# EAGLE design pilly (EAGLE 7.2.0)
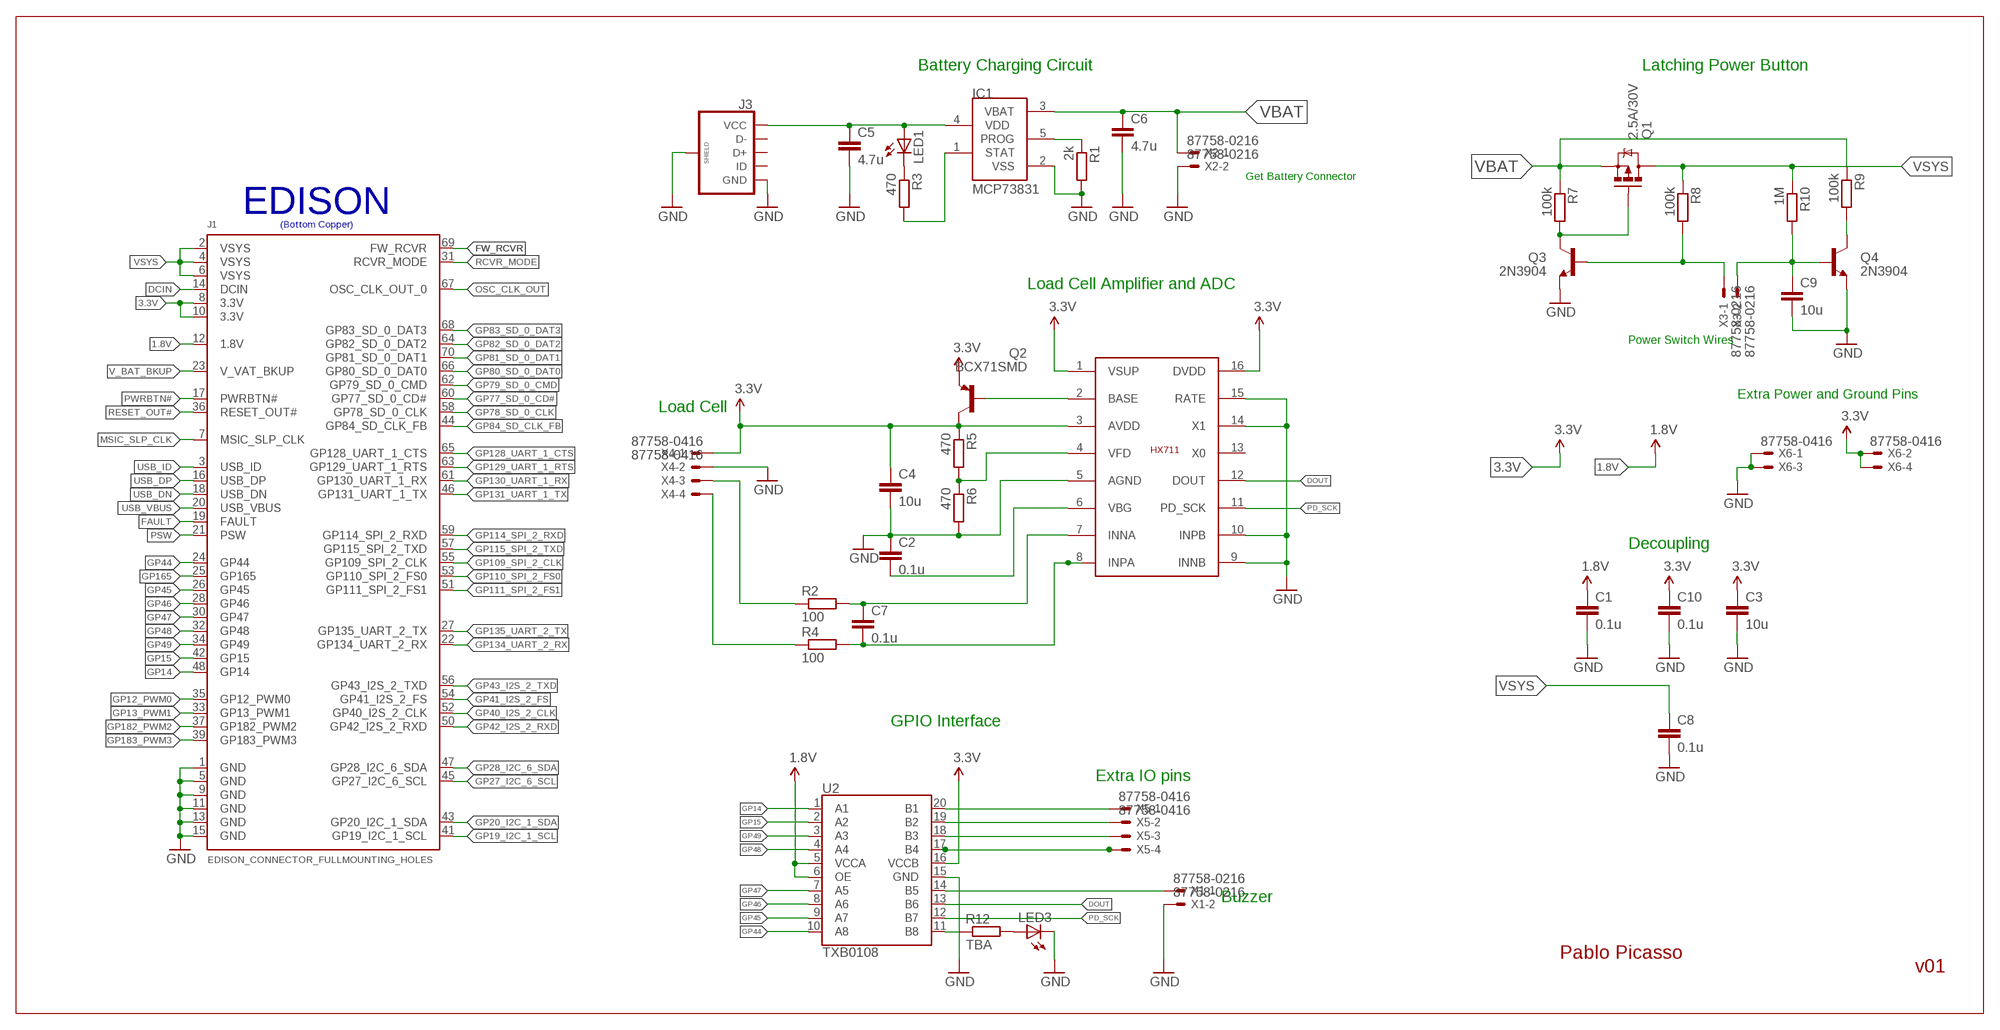
[diagram p0: schematic, sheet 1]

## Parts
C1  0.1u  C-EUC0805K  [C0805K]
C2  0.1u  C-EUC0805K  [C0805K]
C3  10u  C-EUC0805K  [C0805K]
C4  10u  C-EUC0805K  [C0805K]
C5  4.7u  C-EUC0805K  [C0805K]
C6  4.7u  C-EUC0805K  [C0805K]
C7  0.1u  C-EUC0805K  [C0805K]
C8  0.1u  C-EUC0805K  [C0805K]
C9  10u  C-EUC0805K  [C0805K]
C10  0.1u  C-EUC0805K  [C0805K]
IC1  MCP73831  [SOT23-5L]
J1  EDISON_CONNECTOR_FULLMOUNTING_HOLES  [EDISON_DAUGHTER]
J3  USB_MICROB_PLUGCONN-11752  [USB-B-MICRO-SMD_V03]
LED1  LEDCHIPLED_0805  [CHIPLED_0805]
LED3  LEDCHIPLED_0805  [CHIPLED_0805]
Q1  2.5A/30V  MOSFET-PCHANNELDMG2307L  [SOT23-3]
Q2  BCX71SMD  [SOT23]
Q3  2N3904  TRANSISTOR_NPNMMBT2222A  [SOT23-3]
Q4  2N3904  TRANSISTOR_NPNMMBT2222A  [SOT23-3]
R1  2k  R-EU_R0603  [R0603]
R2  100  R-EU_R0603  [R0603]
R3  470  R-EU_R0603  [R0603]
R4  100  R-EU_R0603  [R0603]
R5  470  R-EU_R0603  [R0603]
R6  470  R-EU_R0603  [R0603]
R7  100k  R-EU_R0603  [R0603]
R8  100k  R-EU_R0603  [R0603]
R9  100k  R-EU_R0603  [R0603]
R10  1M  R-EU_R0603  [R0603]
R12  TBA  R-EU_R0603  [R0603]
U2  TXB0108  [UFDFN-20]
U$1  HX711  [SO16]
X1  87758-0216  [87758-0216]
X2  87758-0216  [87758-0216]
X3  87758-0216  [87758-0216]
X4  87758-0416  [87758-0416]
X5  87758-0416  [87758-0416]
X6  87758-0416  [87758-0416]

## Nets
1.8V: C1.1 J1.12(1.8V) U2.5(VCCA) U2.6(OE)
3.3V: C3.1 C4.1 C10.1 J1.8(3.3V) J1.10(3.3V) Q2.2(E) Q2.3(C) R5.1 U2.16(VCCB) U$1.1(VSUP) U$1.3(AVDD) U$1.16(DVDD) X4.1 X6.2 X6.4
DCIN: J1.14(DCIN)
DOUT: U2.13(B6) U$1.12(DOUT)
FAULT: J1.19(FAULT)
FW_RCVR: J1.69(FW_RCVR)
GND: C1.2 C2.1 C3.2 C4.2 C5.2 C6.2 C8.2 C9.2 C10.2 IC1.2(VSS) J1.1(GND) J1.5(GND) J1.9(GND) J1.11(GND) J1.13(GND) J1.15(GND) J3.GND J3.SHIELD1(SHIELD) J3.SHIELD2(SHIELD) J3.SHIELD3(SHIELD) LED3.C Q3.2(E) Q4.2(E) R1.2 R6.2 U2.15(GND) U$1.5(AGND) U$1.9(INNB) U$1.10(INPB) U$1.14(X1) U$1.15(RATE) X1.2 X2.2 X4.2 X6.1 X6.3
GP12_PWM0: J1.35(GP12_PWM0)
GP13_PWM1: J1.33(GP13_PWM1)
GP14: J1.48(GP14) U2.1(A1)
GP15: J1.42(GP15) U2.2(A2)
GP19_I2C_1_SCL: J1.41(GP19_I2C_1_SCL)
GP20_I2C_1_SDA: J1.43(GP20_I2C_1_SDA)
GP27_I2C_6_SCL: J1.45(GP27_I2C_6_SCL)
GP28_I2C_6_SDA: J1.47(GP28_I2C_6_SDA)
GP40_I2S_2_CLK: J1.52(GP40_I2S_2_CLK)
GP41_I2S_2_FS: J1.54(GP41_I2S_2_FS)
GP42_I2S_2_RXD: J1.50(GP42_I2S_2_RXD)
GP43_I2S_2_TXD: J1.56(GP43_I2S_2_TXD)
GP44: J1.24(GP44) U2.10(A8)
GP45: J1.26(GP45) U2.9(A7)
GP46: J1.28(GP46) U2.8(A6)
GP47: J1.30(GP47) U2.7(A5)
GP48: J1.32(GP48) U2.4(A4)
GP49: J1.34(GP49) U2.3(A3)
GP77_SD_0_CD#: J1.60(GP77_SD_0_CD#)
GP78_SD_0_CLK: J1.58(GP78_SD_0_CLK)
GP79_SD_0_CMD: J1.62(GP79_SD_0_CMD)
GP80_SD_0_DAT0: J1.66(GP80_SD_0_DAT0)
GP81_SD_0_DAT1: J1.70(GP81_SD_0_DAT1)
GP82_SD_0_DAT2: J1.64(GP82_SD_0_DAT2)
GP83_SD_0_DAT3: J1.68(GP83_SD_0_DAT3)
GP84_SD_CLK_FB: J1.44(GP84_SD_CLK_FB)
GP109_SPI_2_CLK: J1.55(GP109_SPI_2_CLK)
GP110_SPI_2_FS0: J1.53(GP110_SPI_2_FS0)
GP111_SPI_2_FS1: J1.51(GP111_SPI_2_FS1)
GP114_SPI_2_RXD: J1.59(GP114_SPI_2_RXD)
GP115_SPI_2_TXD: J1.57(GP115_SPI_2_TXD)
GP128_UART_1_CTS: J1.65(GP128_UART_1_CTS)
GP129_UART_1_RTS: J1.63(GP129_UART_1_RTS)
GP130_UART_1_RX: J1.61(GP130_UART_1_RX)
GP131_UART_1_TX: J1.46(GP131_UART_1_TX)
GP134_UART_2_RX: J1.22(GP134_UART_2_RX)
GP135_UART_2_TX: J1.27(GP135_UART_2_TX)
GP165: J1.25(GP165)
GP182_PWM2: J1.37(GP182_PWM2)
GP183_PWM3: J1.39(GP183_PWM3)
MSIC_SLP_CLK: J1.7(MSIC_SLP_CLK)
N$1: LED1.C R3.1
N$2: IC1.5(PROG) R1.1
N$3: U2.14(B5) X1.1
N$5: R5.2 R6.1 U$1.4(VFD)
N$6: IC1.1(STAT) R3.2
N$7: C7.1 R2.2 U$1.7(INNA)
N$8: C7.2 R4.2 U$1.8(INPA)
N$9: C2.2 U$1.6(VBG)
N$10: Q2.1(B) U$1.2(BASE)
N$11: R2.1 X4.3
N$12: R4.1 X4.4
N$15: U2.20(B1) X5.1
N$16: Q1.1(G) Q3.3(C) R7.2
N$17: Q4.3(C) R9.2
N$18: C9.1 Q4.1(B) R10.2 X3.2
N$19: U2.19(B2) X5.2
N$20: U2.18(B3) X5.3
N$21: Q3.1(B) R8.2 X3.1
N$23: LED3.A R12.2
N$31: U2.17(B4) X5.4
N$33: R12.1 U2.11(B8)
OSC_CLK_OUT: J1.67(OSC_CLK_OUT_0)
PD_SCK: U2.12(B7) U$1.11(PD_SCK)
PSW: J1.21(PSW)
PWRBTN#: J1.17(PWRBTN#)
RCVR_MODE: J1.31(RCVR_MODE)
RESET_OUT#: J1.36(RESET_OUT#)
USB_DN: J1.18(USB_DN)
USB_DP: J1.16(USB_DP)
USB_ID: J1.3(USB_ID)
USB_VBUS: J1.20(USB_VBUS)
V_BAT_BKUP: J1.23(V_VAT_BKUP)
VBAT: C6.1 IC1.3(VBAT) Q1.2(S) R7.1 R9.1 X2.1
VIN: C5.1 IC1.4(VDD) J3.VBUS(VCC) LED1.A
VSYS: C8.1 J1.2(VSYS) J1.4(VSYS) J1.6(VSYS) Q1.3(D) R8.1 R10.1
Unconnected: J3.D+ J3.D- J3.ID U$1.13(X0)

## Notes on the sheet
- Battery Charging Circuit | Latching Power Button
- Get Battery Connector
- EDISON
- (Bottom Copper)
- Load Cell Amplifier and ADC
- Power Switch Wires
- Extra Power and Ground Pins
- Load Cell
- Decoupling
- GPIO Interface
- Extra IO pins
- Buzzer
- Pablo Picasso
- v01

## Library data of the parts
C1-C10 = rcl:C-EU: CAPACITOR, European symbol
IC1 = microchip-update-2:MCP73831: Miniature Single-Cell, Fully Integrated Li-Ion, Li-Polymer Charge Management Controllers
J1 = Edison:EDISON_CONNECTOR_FULL
J3 = SparkFun-Connectors:USB_MICROB_PLUG: USB Micro-B connectors Some male, some female. Watch your step!; PROD_ID: CONN-11752
LED1 LED3 = led:LED: LED OSRAM: - CHIPLED LG R971, LG N971, LY N971, LG Q971, LY Q971, LO R971, LY R971 LH N974, LH R974 LS Q976, LO Q976, LY Q976 LO Q996 - Hyper CHIPLED LW Q18S LB Q993, LB Q99A, LB R99A - SideLED LS A670, LO A670, LY A670, LG A670, LP A670 LB A673, LV A673, LT A673, LW A673 LH A674 LY A675 LS A676, LA A676, LO A676, LY A676, LW A676 LS A679, LY A679, LG A679 - Hyper Micro SIDELED® LS Y876, LA Y876, LO Y876, LY Y876 LT Y87S - SmartLED LW L88C, LW L88S LB L89C, LB L89S, LG L890 LS L89K, LO L89K, LY L89K LS L896, LA L896, LO L896, LY L896 - TOPLED LS T670, LO T670, LY T670, LG T670, LP T670 LSG T670, LSP T670, LSY T670, LOP T670, LYG T670 LG T671, LOG T671, LSG T671 LB T673, LV T673, LT T673, LW T673 LH T674 LS T676, LA T676, LO T676, LY T676, LB T676, LH T676, LSB T676, LW T676 LB T67C, LV T67C, LT T67C, LS T67K, LO T67K, LY T67K, LW E67C LS E67B, LA E67B, LO E67B, LY E67B, LB E67C, LV E67C, LT E67C LW T67C LS T679, LY T679, LG T679 LS T770, LO T770, LY T770, LG T770, LP T770 LB T773, LV T773, LT T773, LW T773 LH T774 LS E675, LA E675, LY E675, LS T675 LS T776, LA T776, LO T776, LY T776, LB T776 LHGB T686 LT T68C, LB T68C - Hyper Mini TOPLED® LB M676 - Mini TOPLED Santana® LG M470 LS M47K, LO M47K, LY M47K Source: http://www.osram.convergy.de LUXEON: - LUMILED® LXK2-PW12-R00, LXK2-PW12-S00, LXK2-PW14-U00, LXK2-PW14-V00 LXK2-PM12-R00, LXK2-PM12-S00, LXK2-PM14-U00 LXK2-PE12-Q00, LXK2-PE12-R00, LXK2-PE12-S00, LXK2-PE14-T00, LXK2-PE14-U00 LXK2-PB12-K00, LXK2-PB12-L00, LXK2-PB12-M00, LXK2-PB14-N00, LXK2-PB14-P00, LXK2-PB14-Q00 LXK2-PR12-L00, LXK2-PR12-M00, LXK2-PR14-Q00, LXK2-PR14-R00 LXK2-PD12-Q00, LXK2-PD12-R00, LXK2-PD12-S00 LXK2-PH12-R00, LXK2-PH12-S00 LXK2-PL12-P00, LXK2-PL12-Q00, LXK2-PL12-R00 Source: www.luxeon.com KINGBRIGHT: KA-3528ASYC Source: www.kingbright.com
Q1 = SparkFun-DiscreteSemi:MOSFET-PCHANNEL: Generic PMOSFET IRLML2244 - TRANS-11153 (SOT-23 -20V -4.3A) (1.Gate 2.Source 3.Drain) FQP27P06 - COM-10349 <http://www.sparkfun.com/products/10349> (TO-220 -60V -27A) (1.Gate 2.Source 3.Drain); PROD_ID: TRANS-11308
Q2 = transistor-pnp:BCX71SMD: PNP Transistor
Q3 Q4 = SparkFun-DiscreteSemi:TRANSISTOR_NPN: Generic NPN BJT MMBT2222A - TRANS-08049 (SOT-23, 1A 40V) MPSA42 - TRANS-09116 (SOT-23, 500mA 300V) MMBT5088LT1G - TRANS-11160 (SOT-23, 50 mA 30V) BC547 - COM-08928 <http://www.sparkfun.com/products/8928> (TO-92 45V 100mA) (1.Collector 2.Base 3.Emitter) 2N3904 - COM-00521 <http://www.sparkfun.com/products/521> (TO-92 40V 200mA) (1.Emitter 2.Base 3.Collector) P2N2222A - COM-12852 <http://www.sparkfun.com/products/12852> (TO-92 40V 600mA) (1.Collector 2.Base 3.Emitter); PROD_ID: TRANS-08049; VALUE: MMBT2222A
R1-R10 R12 = rcl:R-EU_: RESISTOR, European symbol
U2 = SparkFun-DigitalIC:TXB0108: 8-Bit Bi-Directional Level Shifter 1.2V-3.6V (VCCA) to 1.65V-5.5V (VCCB) bi-directional level shifter with auto direction sensing. Max data rate - VCCA 1.2V: 20Mbps (50ns), VCCA 3.3V: 100Mbps (10ns) Digikey: 296-27217-1-ND (20-UFDFN) IC-12292; PROD_ID: IC-12292
U$1 = HX711:HX711
X1-X3 = con-molex:87758-0216: 2 Pin - 2mm Dual Row Single Wafer, Vertical T/H HDR Source: http://www.molex.com/pdm_docs/sd/877580616_sd.pdf; MPN: 87758-0216; OC_FARNELL: unknown; OC_NEWARK: 94M1513
X4-X6 = con-molex:87758-0416: 4 Pin - 2mm Dual Row Single Wafer, Vertical T/H HDR Source: http://www.molex.com/pdm_docs/sd/877580616_sd.pdf; MF: FARNELL; MPN: 87758-0416; OC_FARNELL: 7472315; OC_NEWARK: 39K3681

## Board
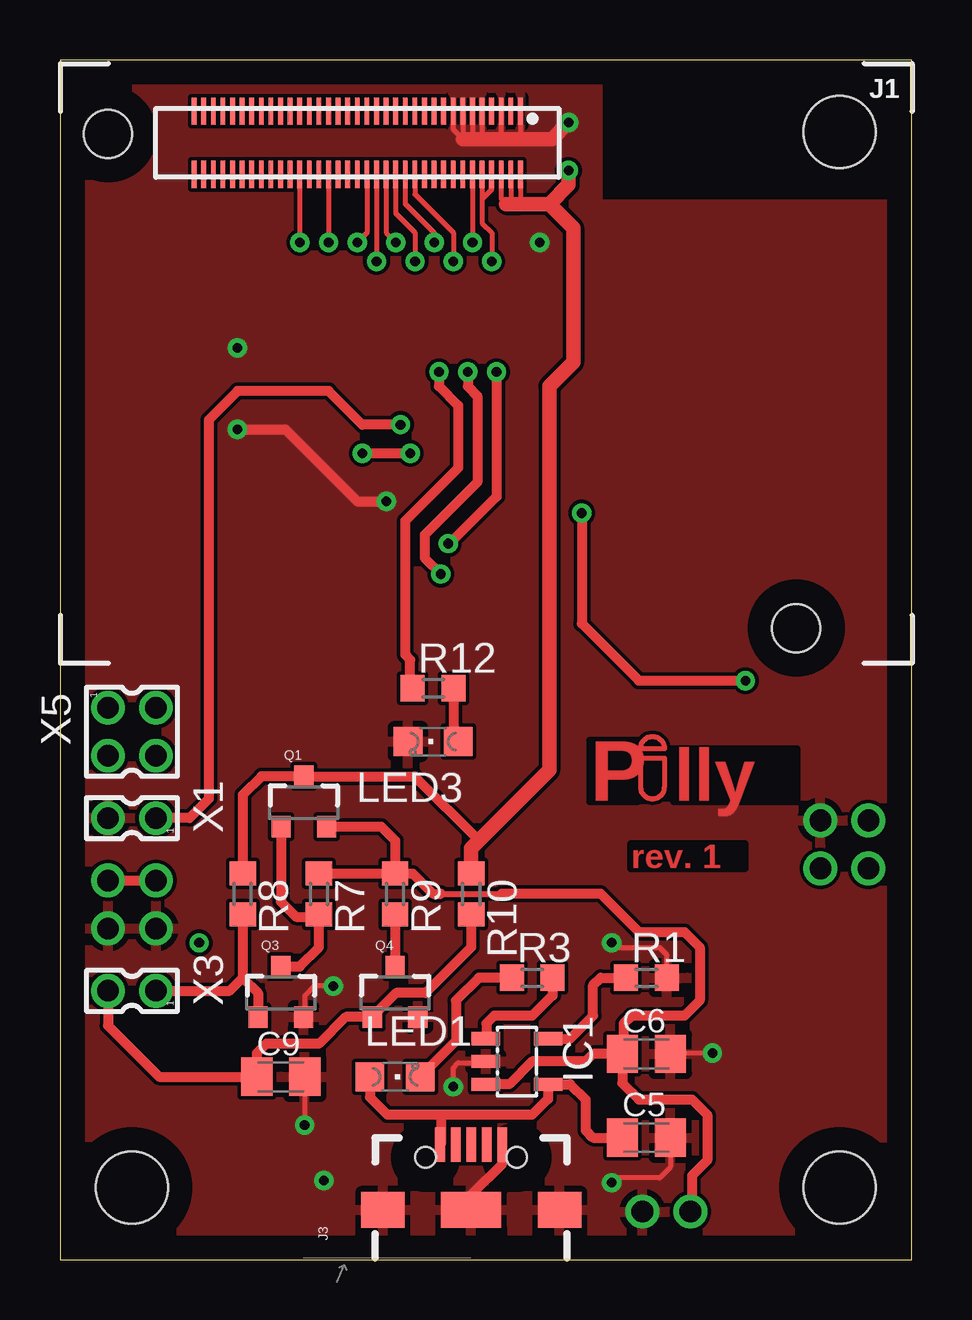
[diagram p1: board, top side]
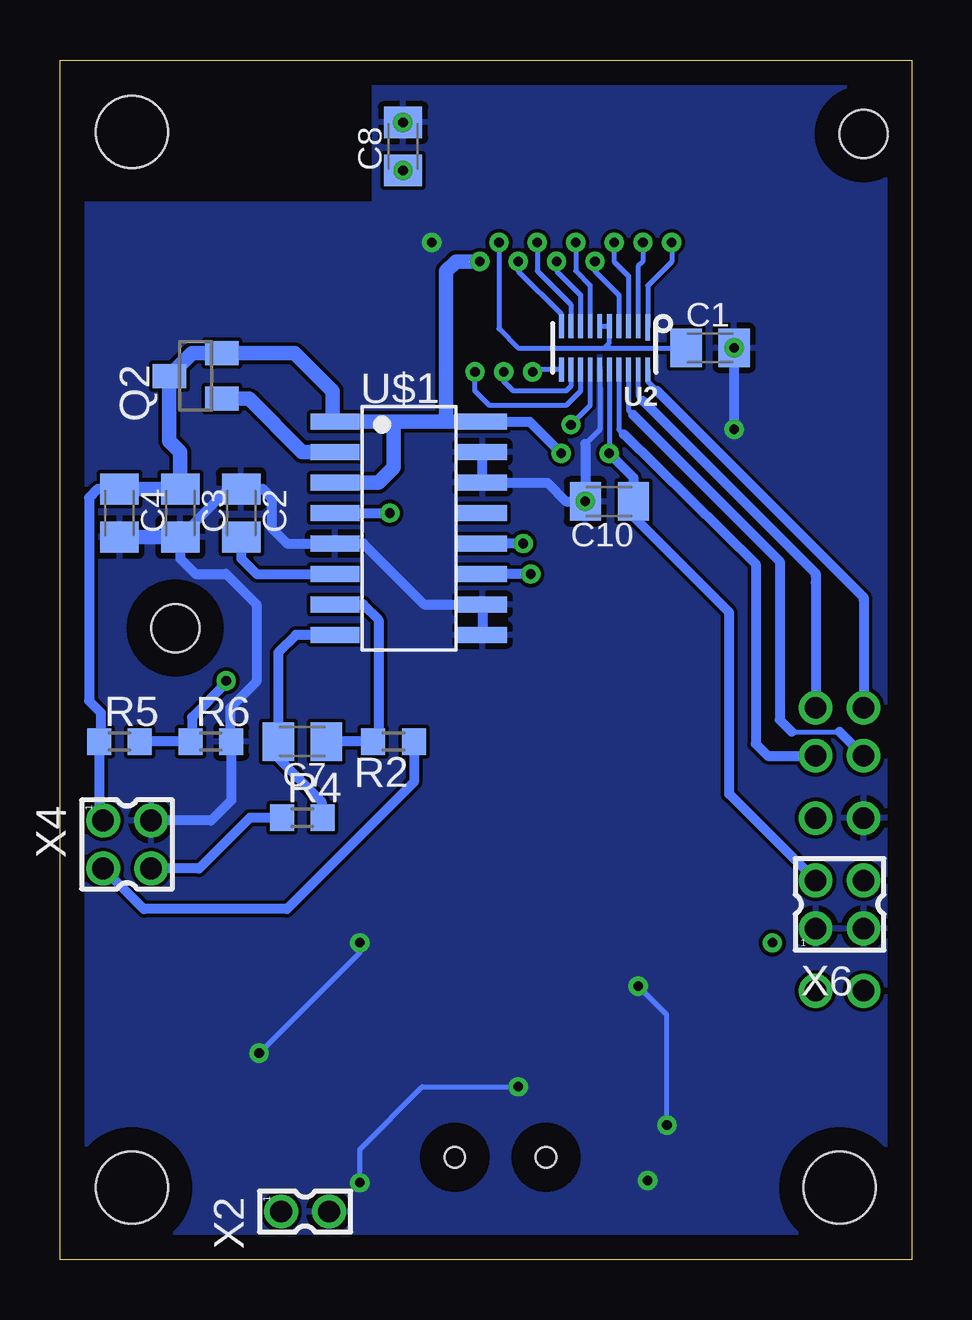
[diagram p2: board, bottom side, seen from below]

Size 35.5 x 50 mm. Coordinates in mm from the lower left corner, seen from the top.
Outline: 0,0 35.5,0 35.5,50 0,50 0,0
Copper layers (1*16): Top 0.035mm / dielectric 1.5mm / Bottom 0.035mm
Design rules "default *": minimum track width 6mil, minimum drill 0.4mm, track to track 6mil, track to pad 6mil, pad to pad 6mil, via to via 6mil, smd to smd 6mil, copper to edge 40mil, drill to drill 8mil, minimum pad ring 10mil, minimum via ring 8mil, stop-mask expansion 4mil, vias tented up to drill 0mil, thermal gap 10mil
Holes 3 mm at 3,3 32.5,3 32.5,47

### Footprints (pad centres in the part's own frame; a part is rotated, then mirrored left to right if it is on the bottom)
C0805K = smd 1.3 x 1.6: 1 -1,0; 2 1,0
SOT23-5L = smd 0.55 x 1.2: 1 -0.95,-1.3; 2 0,-1.3; 3 0.95,-1.3; 4 0.95,1.3; 5 -0.95,1.3
EDISON_DAUGHTER = smd 1.14 x 0.2: 1 1.98,19.17; 2 4.62,19.17; 3 1.98,18.77; 4 4.62,18.77; 5 1.98,18.37; 6 4.62,18.37; 7 1.98,17.97; 8 4.62,17.97; 9 1.98,17.57; 10 4.62,17.57; 11 1.98,17.17; 12 4.62,17.17; 13 1.98,16.77; 14 4.62,16.77; 15 1.98,16.37; 16 4.62,16.37; 17 1.98,15.97; 18 4.62,15.97; 19 1.98,15.57; 20 4.62,15.57; 21 1.98,15.17; 22 4.62,15.17; 23 1.98,14.77; 24 4.62,14.77; 25 1.98,14.37; 26 4.62,14.37; 27 1.98,13.97; 28 4.62,13.97; 29 1.98,13.57; 30 4.62,13.57; 31 1.98,13.17; 32 4.62,13.17; 33 1.98,12.77; 34 4.62,12.77; 35 1.98,12.37; 36 4.62,12.37; 37 1.98,11.97; 38 4.62,11.97; 39 1.98,11.57; 40 4.62,11.57; 41 1.98,11.17; 42 4.62,11.17; 43 1.98,10.77; 44 4.62,10.77; 45 1.98,10.37; 46 4.62,10.37; 47 1.98,9.97; 48 4.62,9.97; 49 1.98,9.57; 50 4.62,9.57; 51 1.98,9.17; 52 4.62,9.17; 53 1.98,8.77; 54 4.62,8.77; 55 1.98,8.37; 56 4.62,8.37; 57 1.98,7.97; 58 4.62,7.97; 59 1.98,7.57; 60 4.62,7.57; 61 1.98,7.17; 62 4.62,7.17; 63 1.98,6.77; 64 4.62,6.77; 65 1.98,6.37; 66 4.62,6.37; 67 1.98,5.97; 68 4.62,5.97; 69 1.98,5.57; 70 4.62,5.57 | hole 2: 23.53,30.67; 2.93,1.98
USB-B-MICRO-SMD_V03 = smd 1.45 x 0.4: D+ 2.725,0; D- 2.725,0.65; GND 2.725,-1.3; ID 2.725,-0.65; VBUS 2.725,1.3 | smd 1.5 x 1.8: SHIELD1 0,3.685; SHIELD2 0,-3.685 | smd 1.5 x 2.5: SHIELD3 0,0 | hole 0.85: 2.2,1.9; 2.2,-1.9
CHIPLED_0805 = smd 1.2 x 1.2: A 0,-1.05; C 0,1.05
SOT23-3 = smd 0.8 x 0.9: 1 -0.95,-1; 2 0.95,-1; 3 0,1.1
SOT23 = smd 1 x 1.4: 1 -0.95,-1.1; 2 0.95,-1.1; 3 0,1.1
R0603 = smd 1 x 1.1: 1 -0.85,0; 2 0.85,0
UFDFN-20 = smd 0.2 x 1.1: 1 -1.8,-0.85 | smd 0.2 x 1: 2 -1.4,-0.9; 3 -1,-0.9; 4 -0.6,-0.9; 5 -0.2,-0.9; 6 0.2,-0.9; 7 0.6,-0.9; 8 1,-0.9; 9 1.4,-0.9; 10 1.8,-0.9; 11 1.8,0.9; 12 1.4,0.9; 13 1,0.9; 14 0.6,0.9; 15 0.2,0.9; 16 -0.2,0.9; 17 -0.6,0.9; 18 -1,0.9; 19 -1.4,0.9; 20 -1.8,0.9
SO16 = smd 0.66 x 2.032: 1 -4.445,-3.073; 2 -3.175,-3.073; 3 -1.905,-3.073; 4 -0.635,-3.073; 5 0.635,-3.073; 6 1.905,-3.073; 7 3.175,-3.073; 8 4.445,-3.073; 9 4.445,3.073; 10 3.175,3.073; 11 1.905,3.073; 12 0.635,3.073; 13 -0.635,3.073; 14 -1.905,3.073; 15 -3.175,3.073; 16 -4.445,3.073
87758-0216 = drill 0.9 pad 1.27: 1 0,-1; 2 0,1
87758-0416 = drill 0.9 pad 1.27: 1 -1,-1; 2 -1,1; 3 1,-1; 4 1,1

### Placement (x,y rotation side)
C1  8.4,38 0 bottom
C2  27.94,31.11 270 bottom
C3  30.48,31.11 270 bottom
C4  33.02,31.11 270 bottom
C5  24.45,5.08 0 top
C6  24.45,8.57 0 top
C7  25.4,21.59 180 bottom
C8  21.2,46.4 90 bottom
C9  9.21,7.62 0 top
C10  12.6,31.6 180 bottom
IC1  19.05,8.26 270 top
J1  0.03,49.85 270 top
J3  17.14,2.06 90 top
LED1  13.97,7.62 270 top
LED3  15.56,21.59 90 top
Q1  10.17,19.04 0 top
Q2  29.84,36.83 90 bottom
Q3  9.21,11.11 0 top
Q4  13.97,11.11 0 top
R1  24.45,11.75 0 top
R2  21.59,21.59 180 bottom
R3  19.68,11.75 0 top
R4  25.4,18.41 0 bottom
R5  33.02,21.59 0 bottom
R6  29.21,21.59 0 bottom
R7  10.79,15.24 270 top
R8  7.62,15.24 270 top
R9  13.97,15.24 270 top
R10  17.14,15.24 270 top
R12  15.56,23.81 0 top
U2  12.8,38 180 bottom
U$1  20.95,30.48 270 bottom
X1  3,18.4 90 top
X2  25.28,2 270 bottom
X3  3,11.2 90 top
X4  32.7,17.3 270 bottom
X5  3,22 270 top
X6  3,14.8 0 bottom

### Tracks (layer width: path | path; a pad name or v marks a point on that pad's centre or on a via)
1.8V  (via drill 0.4)
  Top 0.2: J1.12 v17.2,42.41 v17.2,42.4
  Bottom 0.2: v17.2,42.4 17.2,38.8 16.4,38 12.8,38 | 12.8,38 12.6,38.2 U2.5 U2.6 | 12.8,38 C1.1
3.3V  (via drill 0.4)
  Top 0.2: J1.10 17.59,44.2 | 17.59,44.2 17.59,43.2 18,42.8 v18,41.6 | J1.8 18,44.6 17.59,44.2
  Top 0.406: v14.6,33.6 v12.6,33.6 | X6.4 X6.2
  Bottom 0.2: 19.4,35.12 19.2,34.92 | U2.16 v12.6,33.6
  Bottom 0.406: C4.1 33.92,32.12 34.29,31.75 34.29,23.29 33.8,22.8 33.8,21.66 R5.1 33.87,18.47 X4.1 | U$1.16 15.93,34.92 v14.6,33.6 | X6.2 7.6,19.4 7.6,26.97 11.6,30.97 C10.1 11.6,32.6 v12.6,33.6
  Bottom 0.61: 21.59,34.92 U$1.1 24.13,35.03 24.13,36.2 25.71,37.78 Q2.2 30,37.78 Q2.3 30.95,34.12 30.48,33.66 C3.1 C4.1 | 21.59,34.92 19.2,34.92 U$1.16 | U$1.3 22.23,32.38 21.59,33.02 21.59,34.92 | v18,41.6 19,41.6 19.4,41.2 19.4,35.12
DOUT  (via drill 0.4)
  Top 0.406: v18.2,37 18.2,31.8 16.19,29.79 v16.19,29.84
  Bottom 0.2: U2.13 13.8,36.2 14.4,35.6 17.6,35.6 18.2,36.2 v18.2,37
  Bottom 0.406: v16.19,29.84 U$1.12
GND  (via drill 0.4, 0.4 pad 0.81)
  Top 0.2: J1.15 16.39,47.1 16.8,46.7 | R1.2 25.3,12.7 25,13 23.2,13 v23,13.2 | v27.2,8.6 25.48,8.6 C6.2 | C5.2 25.45,3.85 25,3.4 23.2,3.4 v23,3.2 | v16.4,7.2 16.4,8 16.6,8.2 17.7,8.2 IC1.2 | C9.2 v10.21,5.61 v10.2,5.6 | v11.4,11.4 10.6,11.4 10.2,11 10.2,10.15 Q3.2 | J1.11 17.2,46.91 | 17.2,46.91 17.2,46.9 | J1.9 17.59,46.91 17.6,46.9 | J1.5 18.39,46.91 18.4,46.9 | J1.1 19.2,46.7 | J1.13 16.8,46.91 17,46.7 | 17.2,46.91 17.2,46.7
  Top 0.254: J3.GND 18.45,4 | 17.14,2.7 J3.SHIELD3
  Top 0.406: 18.45,4 17.14,2.7 | v7.4,34.6 9.4,34.6 12.4,31.6 C10.2
  Top 0.61: 16.8,46.7 17,46.7 17.2,46.7 19.2,46.7 20.5,46.7 C8.2
  Bottom 0.2: 15.24,32.38 15.19,32.38 | v23,13.2 23,12.8 v27.2,8.6 | v23,3.2 23,4.6 20.4,7.2 v16.4,7.2 | v10.2,5.6 10.2,10.2 v11.4,11.4 | U2.15 13,34.6 13.6,34
  Bottom 0.406: U$1.15 U$1.14 15.24,32.38 | X4.2 29.2,18.3 28.36,19.14 R6.2 28.4,21.63 28.4,23 27.3,24.09 27.3,27.3 28.57,28.57 29.84,28.57 30.48,29.21 C3.2 28.48,32.12 C2.1 27.04,32.12 26.67,31.75 26.67,30.48 26.04,29.84 U$1.5 22.86,29.84 20.32,27.3 U$1.10 U$1.9 | 15.19,32.38 14.4,31.6 C10.2 13.6,34 | C1.2 v7.4,34.6
  Bottom 0.61: C4.2 C3.2
  other vias: 21.2,47.4 11,3.3 13.6,31.6 7.4,38 20,42.4
  pour Top: 0,0 0.18,49.53 22.4,49.6 22.4,44 35.4,44 35.4,42 35.4,42.09 35.72,0.16
  pour Bottom: 22.4,49.6 22.4,44 35.4,44 35.4,0.2 0.2,0.2 0.2,49.6
GP14  (via drill 0.4)
  Top 0.2: J1.48 v9.99,42.41 v10,42.4
  Bottom 0.2: v10,42.4 10,41.6 11,40.6 U2.1
GP15  (via drill 0.4)
  Top 0.2: J1.42 v11.2,42.41 v11.2,42.4
  Bottom 0.2: v11.2,42.4 11.2,41.6 11.4,41.4 U2.2
GP44  (via drill 0.4)
  Top 0.2: J1.24 14.79,44.41 16.4,42.8 v16.4,41.6
  Bottom 0.2: v16.4,41.6 16.4,41.2 14.6,39.4 U2.10
GP45  (via drill 0.4)
  Top 0.2: J1.26 14.39,44.01 15.6,42.8 v15.6,42.4
  Bottom 0.2: v15.6,42.4 15.6,41.2 14.2,39.8 U2.9
GP46  (via drill 0.4)
  Top 0.2: J1.28 13.99,43.6 14.8,42.8 v14.8,41.6
  Bottom 0.2: v14.8,41.6 14.8,41.2 13.8,40.2 U2.8
GP47  (via drill 0.4)
  Top 0.2: J1.30 13.6,42.8 v14,42.4
  Bottom 0.2: v14,42.4 14,41.2 13.4,40.6 U2.7
GP48  (via drill 0.4)
  Top 0.2: J1.32 v13.2,41.6
  Bottom 0.2: v13.2,41.6 13.2,41.2 12.2,40.2 U2.4
GP49  (via drill 0.4)
  Top 0.2: J1.34 12.79,42.8 v12.4,42.4
  Bottom 0.2: v12.4,42.4 12.4,41.6 11.8,41 U2.3
N$1
  Top 0.406: R3.1 17.46,11.75 16.51,10.79 16.51,9.11 LED1.C
N$2
  Top 0.406: IC1.5 21.27,9.21 22.23,10.16 22.23,11.43 22.54,11.75 R1.1
N$3  (via drill 0.4)
  Top 0.406: v14.2,34.8 12.6,34.8 11.2,36.2 7.4,36.2 6.2,35 6.2,19.2 5.4,18.4 X1.1
  Bottom 0.2: U2.14 13.4,35.6 v14.2,34.8
N$4
  Top 0.2: 24.2,21.3 25.2,21.3 arc180 24.2,21.3
N$5  (via drill 0.4)
  Top 0.406: v28.57,24.13 24.13,24.13 21.75,26.5 v21.75,31.11
  Bottom 0.406: R5.2 R6.1 30,21.65 30,22.6 28.57,24.02 v28.57,24.13 | U$1.4 v21.75,31.11
N$6
  Top 0.2: 17.78,9.23 IC1.1
  Top 0.406: R3.2 20.54,11.01 19.68,10.16 18.1,10.16 17.78,9.84 17.78,9.23
N$7
  Bottom 0.406: U$1.7 22.86,27.3 22.23,26.67 22.23,21.8 R2.2 C7.1
N$8
  Bottom 0.406: U$1.8 25.66,26.04 26.4,25.3 C7.2 26.4,20.9 24.6,19.1 24.6,18.46 R4.2
N$9
  Bottom 0.406: C2.2 27.94,29.21 27.3,28.57 U$1.6
N$10
  Bottom 0.61: Q2.1 27.62,35.88 25.4,33.66 U$1.2
N$11
  Bottom 0.406: R2.1 20.74,19.9 26.04,14.61 32,14.61 X4.3
N$12
  Bottom 0.406: R4.1 27.59,18.41 29.7,16.3 X4.4
N$14
  Top 0.2: 24.2,20.9 25.2,20.9 25.2,19.7 arc-180 24.2,19.7 24.2,20.9
N$15
  Bottom 0.2: U2.20 11,36.6 10.6,36.2
  Bottom 0.406: X5.1 2,27.5 2,27.6 10.6,36.2
N$16
  Top 0.2: 10.69,14.29 R7.2
  Top 0.406: Q3.3 9.99,12.21 10.79,13.02 R7.2 | Q1.1 9.22,14.91 9.84,14.29 10.69,14.29
N$17
  Top 0.406: R9.2 Q4.3
N$18
  Top 0.406: X3.2 2,9.75 4.13,7.62 C9.1 8.2,8.6 8.6,9 10.8,9 11.91,10.11 Q4.1 14.02,11.11 15.24,11.11 17.14,13.02 R10.2
N$19
  Bottom 0.2: U2.19 11.4,36 11.2,35.8
  Bottom 0.406: X5.2 4,28.2 4,28.5 4,28.6 11.2,35.8
N$20
  Bottom 0.2: 5,22 3,22 | U2.18 11.8,35.4 11.6,35.2
  Bottom 0.406: 5,22 5.5,22.5 5.5,29.1 11.6,35.2 | 3,22 X5.3
N$21
  Top 0.2: Q3.1
  Top 0.406: R8.2 7.62,11.75 | 7.62,11.75 8.26,11.11 Q3.1 | X3.1 7.07,11.2 7.62,11.75
N$22  (via drill 0.4)
  other vias: 5.8,13.2
N$23
  Top 0.406: R12.2 16.41,21.79 LED3.A
N$31
  Bottom 0.2: U2.17 12.2,34.6 12,34.4
  Bottom 0.406: X5.4 6,21 6.5,21.5 6.5,29 12,34.4
N$33  (via drill 0.4)
  Top 0.2: 14.4,23.86 R12.1
  Top 0.406: v15.8,37 15.8,36.4 16.6,35.6 16.6,33 14.4,30.8 14.4,25.2 14.6,25 14.6,23.8 14.54,23.86 14.4,23.86
  Bottom 0.2: U2.11 15.7,37.1 v15.8,37
PD_SCK  (via drill 0.4)
  Top 0.406: v17,37 17,36.4 17.4,36 17.4,32.4 15.2,30.2 15.2,29.25 v15.88,28.57
  Bottom 0.2: U2.12 14.2,36.4 14.4,36.2 16.6,36.2 17,36.6 v17,37
  Bottom 0.406: v15.88,28.57 U$1.11
VBAT
  Top 0.2: IC1.3 | 23.5,8.62 C6.1 | 26.35,2.07 X2.1
  Top 0.254: 15.88,15.24 18.41,15.24
  Top 0.406: R9.1 14.71,16.09 15.56,15.24 15.88,15.24 | R7.1 R9.1 | IC1.3 18.73,7.3 19.68,8.26 21.91,8.26 22.23,8.57 C6.1 23.45,7.35 24.13,6.67 26.35,6.67 26.99,6.03 26.99,4.13 26.35,3.49 26.35,2.07 | 23.5,8.62 23.5,9.84 23.81,10.16 26.04,10.16 26.67,10.79 26.67,13.02 26.04,13.65 24.13,13.65 22.54,15.24 18.41,15.24 | Q1.2 13.39,18.04 13.97,17.46 R9.1
VIN
  Top 0.2: 15.88,4.82 J3.VBUS
  Top 0.406: C5.1 22.23,5.08 21.91,5.4 21.91,6.67 21.27,7.3 IC1.4 20.35,6.7 19.68,6.03 15.88,6.03 | LED1.A 12.92,6.76 13.65,6.03 15.88,6.03 | 15.88,6.03 15.88,4.82
VSYS  (via drill 0.4)
  Top 0.2: J1.6 18.39,44.2 18.6,44 | J1.4 18.8,44.01 18.8,44 | J1.2 19.2,44.01 19.2,44
  Top 0.406: R8.1 7.62,19.37 8.4,20.14 Q1.3 14.78,20.14 17.46,17.46
  Top 0.61: 20.4,44 21.4,43 21.4,37.4 20.4,36.4 20.4,20.4 17.46,17.46 17.14,17.14 R10.1 | 18.6,44 18.8,44 19.2,44 20.4,44 | C8.1 21.2,44.8 20.4,44
  other vias: 21.2,45.4

### Text on the board
Top: P | lly | rev. 1